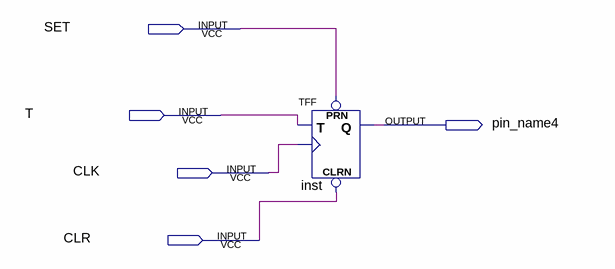
[diagram p0: schematic sheet]
// Quartus schematic ea01m02e02T.bdf as structural Verilog: 1 symbols, 5 pins
module ea01m02e02T (
  input  SET,
  input  T,
  input  CLK,
  input  CLR,
  output pin_name4
);

  TFF inst (.PRN(SET), .CLRN(CLR), .T(T), .CLK(CLK), .Q(pin_name4));
endmodule
